# EasyEDA schematic schematic.json
TITLE: Sheet_1; REV: 1.0; Date: 2024-12-08; Sheet: 1/1; Drawn By: lucas170; Company: Your Company
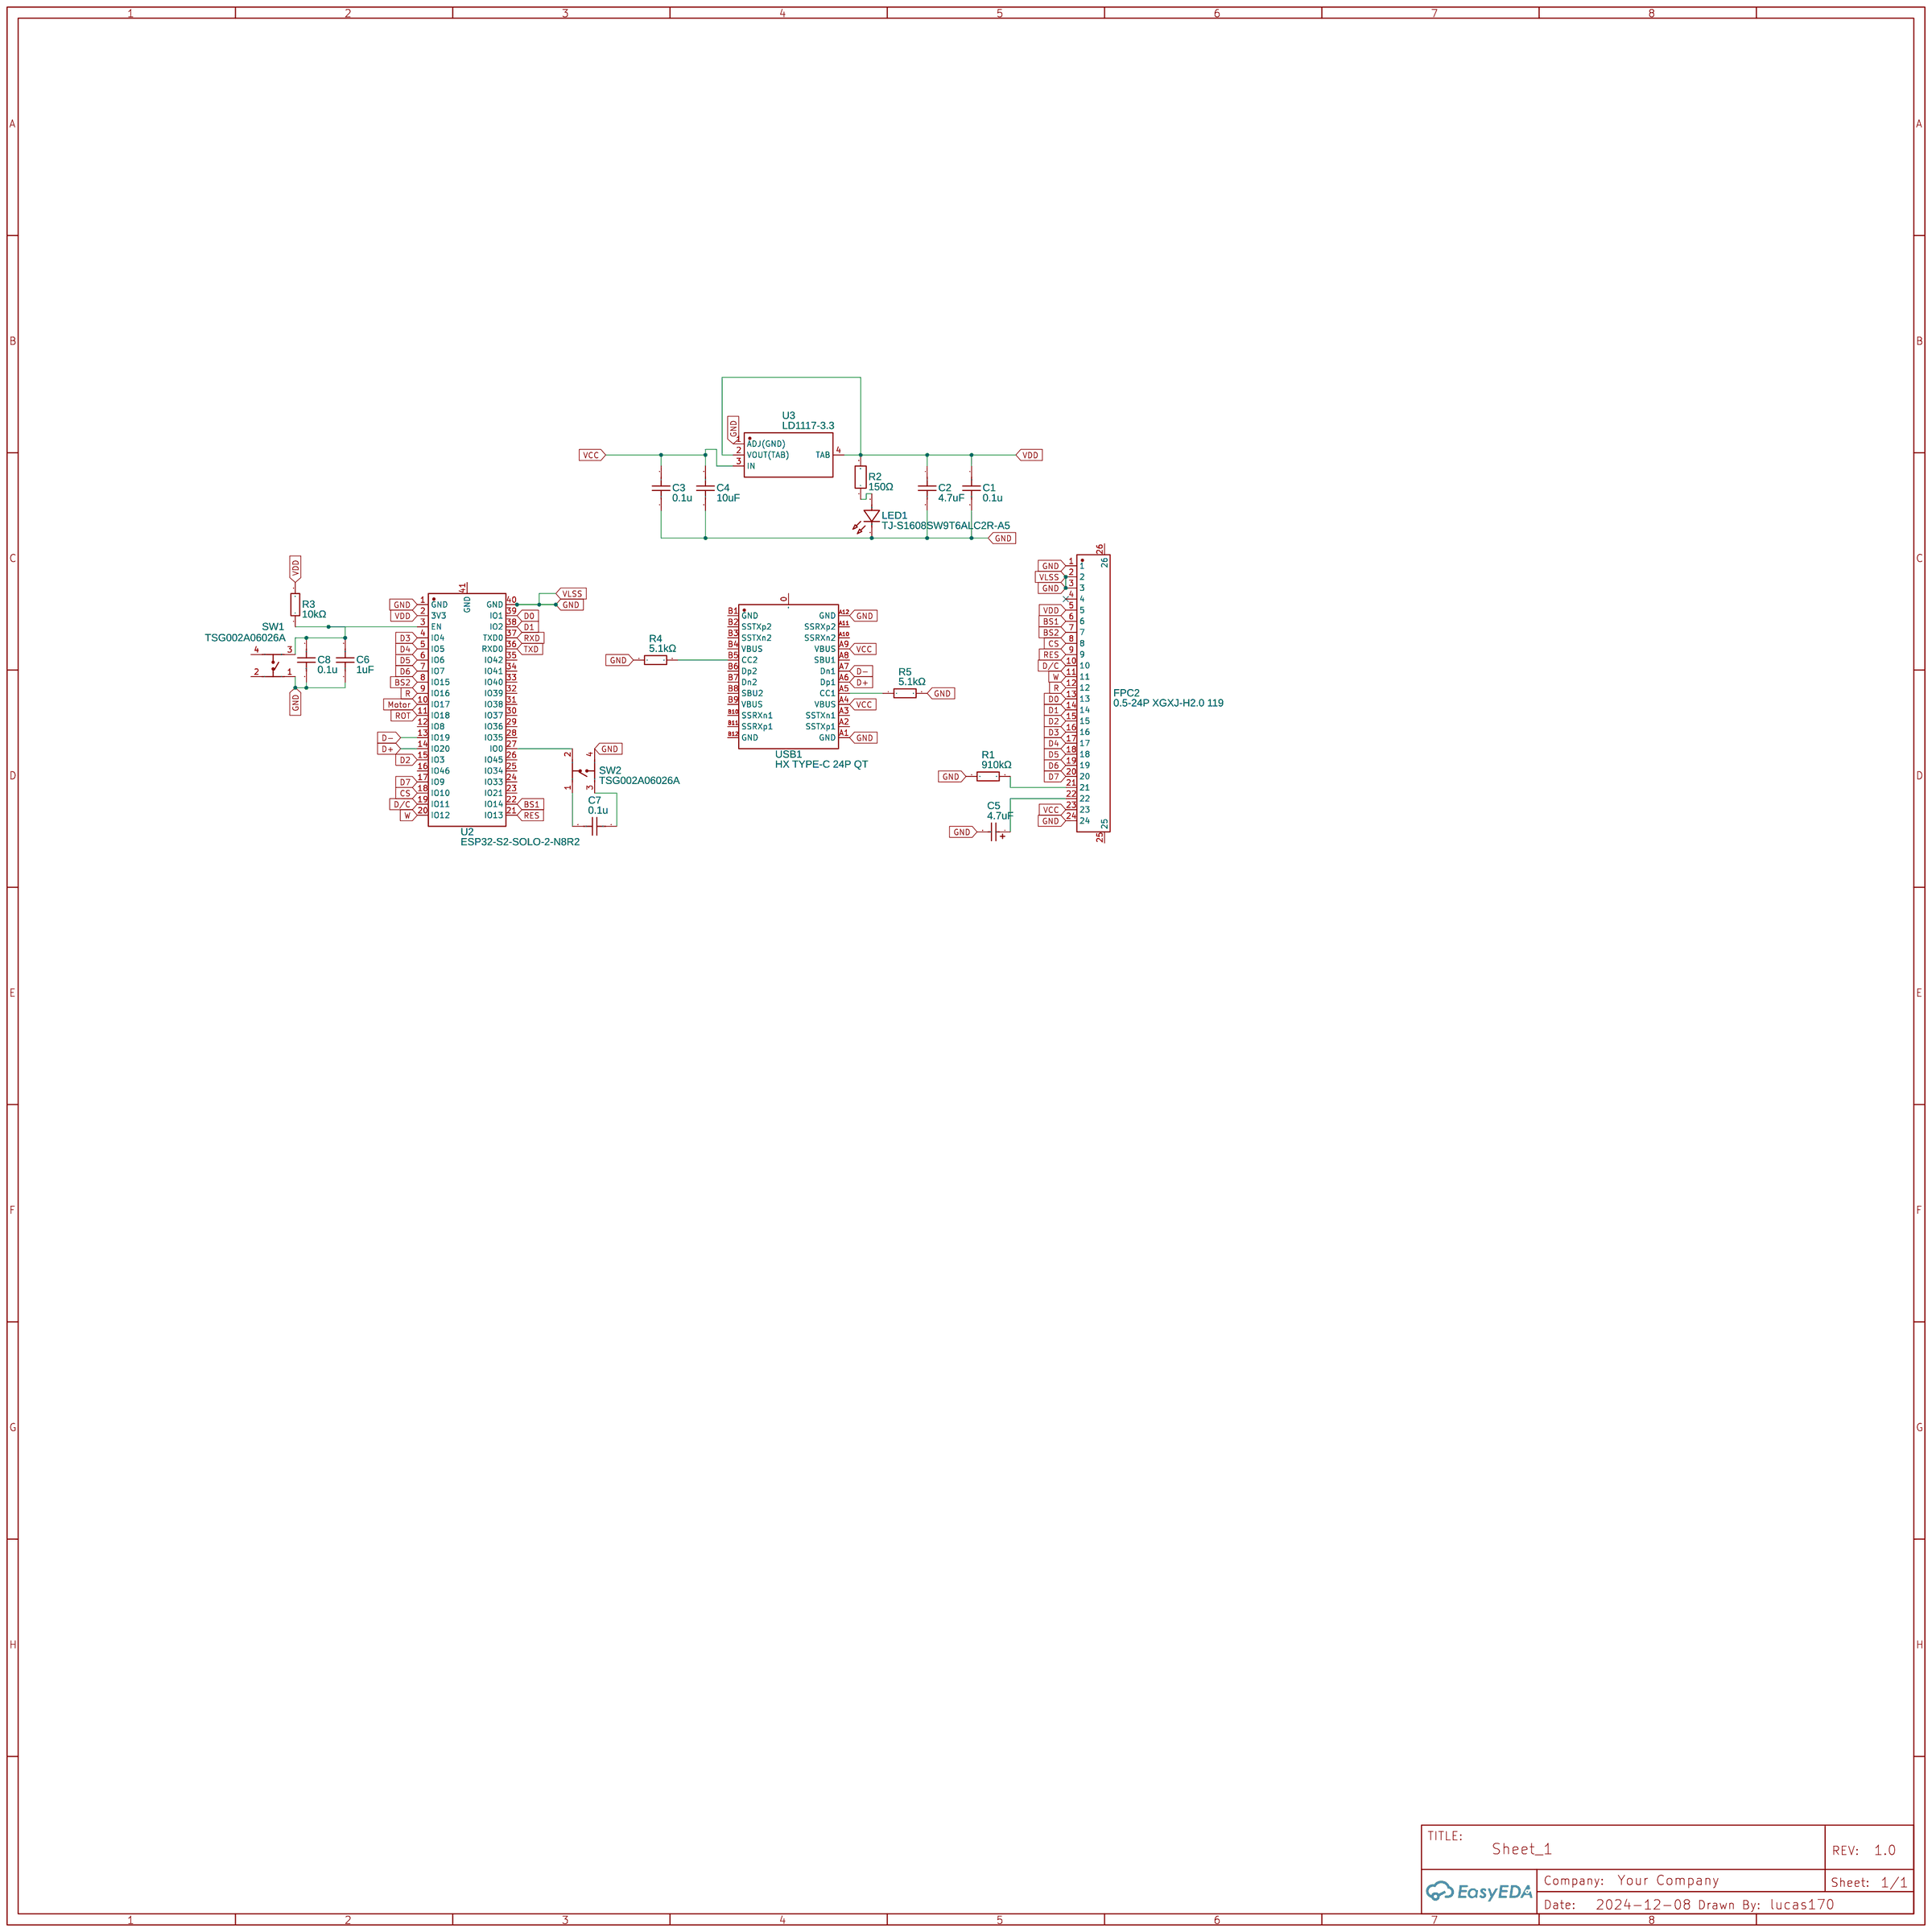
[diagram p0: schematic sheet]

## Parts
C1  0.1u  [_0402]
C2  4.7uF  [C1206]
C3  0.1u  [_0402]
C4  10uF  [C1210]
C5  4.7uF  [CASE-A_3216]
C6  1uF  [C0402]
C7  0.1u  [_0402]
C8  0.1u  [_0402]
FPC2  0.5-24P XGXJ-H2.0 119  [FPC-SMD_24P-P0.50_SHOU-HAN_XGXJ-H2.0]
LED1  TJ-S1608SW9T6ALC2R-A5  [LED0603-RD_RED]
R1  910kΩ  [R0805]
R2  150Ω  [R0603]
R3  10kΩ  [R0603]
R4  5.1kΩ  [R0805]
R5  5.1kΩ  [R0805]
SW1  TSG002A06026A  [SW-SMD_4P-L6.2-W6.2-P4.50-LS9.2]
SW2  TSG002A06026A  [SW-SMD_4P-L6.2-W6.2-P4.50-LS9.2]
U2  ESP32-S2-SOLO-2-N8R2  [WIRELM-SMD_ESP32-S3-WROOM-1]
U3  LD1117-3.3  [SOT-223_L6.7-W3.5-P2.30-BR]
USB1  HX TYPE-C 24P QT  [USB-C-SMD_HX-TYPE-C-24P-QT]

## Library data of the parts
C1 C3 C7 C8 = 0.1u: Supplier Part: C513772; Supplier: LCSC; Contributor: LCEDA_Lib; Manufacturer Part: CS1005X7R104K500NR; Manufacturer: Samwha Capacitor; link: https://www.lcsc.com/product-detail/Multilayer-Ceramic-Capacitors-MLCC-SMD-SMT_Samwha-span-style-background-color-ff0-Capacitor-span-CS1005X7R104K500NR_C513772.html
C2 = CS3216X7R475K500NRI: Contributor: LCSC; Supplier: LCSC; Supplier Part: C513768; Manufacturer: SAMWHA(三和); JLCPCB Part Class: Extended Part
C4 = CS3225X7R106K500NRL: Supplier: LCSC; Supplier Part: C2918502; Manufacturer: SAMWHA(三和); JLCPCB Part Class: Extended Part; Contributor: lcsc
C5 = TAJA475K020RNJ: Supplier: LCSC; Manufacturer: Kyocera AVX; Supplier Part: C7188; JLCPCB Part Class: Extended Part
C6 = TCC0402X5R105M100AT: Contributor: lcsc; Supplier: LCSC; Supplier Part: C2887020; Manufacturer: CCTC(三环); JLCPCB Part Class: Extended Part
FPC2 = 0.5-24P XGXJ-H2.0 119: Contributor: LCSC; Supplier: LCSC; Supplier Part: C2858298; Manufacturer: SHOU HAN(首韩); JLCPCB Part Class: Extended Part
LED1 = TJ-S1608SW9T6ALC2R-A5: Contributor: LCSC; Supplier: LCSC; Supplier Part: C601657; Manufacturer: TOGIALED(统佳); JLCPCB Part Class: Extended Part
R1 = 0805W8F9103T5E: Supplier: LCSC; Manufacturer: UNI-ROYAL(厚声); Supplier Part: C17864; JLCPCB Part Class: Extended Part
R2 = PTFR0603B150RN9: Contributor: lcsc; Supplier: LCSC; Supplier Part: C2692872; Manufacturer: RESI(开步睿思); JLCPCB Part Class: Extended Part
R3 = RC0603FR-0710KL: Supplier: LCSC; Manufacturer: YAGEO(国巨); Supplier Part: C98220; JLCPCB Part Class: Extended Part
R4 R5 = RTT05512JTP: Supplier: LCSC; Manufacturer: RALEC(旺诠); Supplier Part: C104384; JLCPCB Part Class: Extended Part
SW1 SW2 = TSG002A06026A: Contributor: LCSC; Supplier: LCSC; Supplier Part: C2888623; Manufacturer: BZCN(博众电气); JLCPCB Part Class: Extended Part
U2 = ESP32-S2-SOLO-2-N8R2: Supplier: LCSC; Supplier Part: C9900065648; Manufacturer: null; Contributor: lcsc
U3 = LD1117-3.3: Contributor: LCSC; Supplier: LCSC; Supplier Part: C347229; Manufacturer: UMW(友台半导体); JLCPCB Part Class: Extended Part
USB1 = HX TYPE-C 24P QT: Supplier: LCSC; Supplier Part: C5178546; Manufacturer: hanxia(韩下); JLCPCB Part Class: Extended Part; Contributor: lcsc

## Nets
GND: C1.2 C2.2 C3.1 C4.1 C5.2 C6.1 C8.2 FPC2.1 FPC2.2 FPC2.3 FPC2.24 LED1.1(K) R1.1 R4.1 R5.2 SW1.1 SW2.4 U2.1(GND) U2.40(GND) U3.1(ADJ(GND)) USB1.A1(GND) USB1.A12(GND)
VCC: C3.2 C4.2 FPC2.23 U3.3(IN) USB1.A4(VBUS) USB1.A9(VBUS)
VDD: C1.1 C2.1 FPC2.5 R2.2 R3.2 U2.2(3V3) U3.2(VOUT(TAB)) U3.4(TAB)
BS1: FPC2.6 U2.22(IO14)
BS2: FPC2.7 U2.8(IO15)
CS: FPC2.8 U2.18(IO10)
D0: FPC2.13 U2.39(IO1)
D1: FPC2.14 U2.38(IO2)
D2: FPC2.15 U2.15(IO3)
D3: FPC2.16 U2.4(IO4)
D4: FPC2.17 U2.5(IO5)
D5: FPC2.18 U2.6(IO6)
D6: FPC2.19 U2.7(IO7)
D7: FPC2.20 U2.17(IO9)
D+: U2.14(IO20) USB1.A6(Dp1)
D-: U2.13(IO19) USB1.A7(Dn1)
D/C: FPC2.10 U2.19(IO11)
Motor: U2.10(IO17)
R: FPC2.12 U2.9(IO16)
RES: FPC2.9 U2.21(IO13)
ROT: U2.11(IO18)
RXD: U2.37(TXD0)
TXD: U2.36(RXD0)
W: FPC2.11 U2.20(IO12)
Net-(C5-1): C5.1 FPC2.22
Net-(C6-2): C6.2 C8.1 R3.1 SW1.3 U2.3(EN)
Net-(C7-1): C7.1 SW2.3
Net-(C7-2): C7.2 SW2.1
Net-(FPC2-21): FPC2.21 R1.2
Net-(LED1-2): LED1.2(A) R2.1
Net-(R4-2): R4.2 USB1.B5(CC2)
Net-(R5-1): R5.1 USB1.A5(CC1)
Net-(SW2-2): SW2.2 U2.27(IO0)

Not connected (* = marked no-connect by the designer): FPC2 4* 25 26; SW1 2 4; U2 12(IO8) 16(IO46) 23(IO21) 24(IO33) 25(IO34) 26(IO45) 28(IO35) 29(IO36) 30(IO37) 31(IO38) 32(IO39) 33(IO40) 34(IO41) 35(IO42) 41(GND); USB1 0(SHEELD) A2(SSTXp1) A3(SSTXn1) A8(SBU1) A10(SSRXn2) A11(SSRXp2) B1(GND) B2(SSTXp2) B3(SSTXn2) B4(VBUS) B6(Dp2) B7(Dn2) B8(SBU2) B9(VBUS) B10(SSRXn1) B11(SSRXp1) B12(GND)
